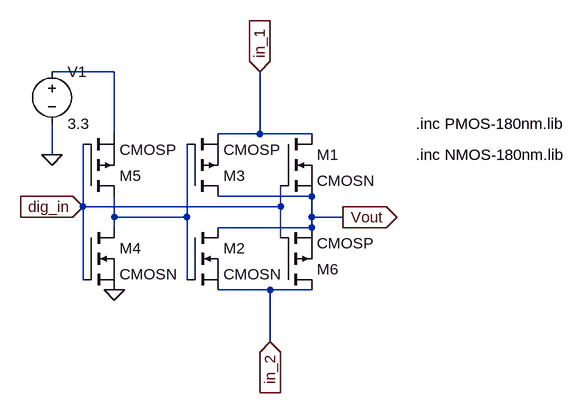
[diagram p0: schematic switch.asc]
switch.asc, the LTspice schematic file:
Version 4
SHEET 1 952 680
WIRE -16 -48 -112 -48
WIRE -16 48 -16 -48
WIRE 208 48 208 -48
WIRE 208 48 144 48
WIRE 288 48 208 48
WIRE -112 80 -112 32
WIRE 288 144 144 144
WIRE -64 160 -64 64
WIRE 240 160 240 128
WIRE 240 160 -64 160
WIRE -16 176 -16 144
WIRE 96 176 96 64
WIRE 96 176 -16 176
WIRE 288 176 288 144
WIRE 336 176 288 176
WIRE -16 192 -16 176
WIRE 288 192 288 176
WIRE 288 192 144 192
WIRE 240 208 240 160
WIRE -64 272 -64 160
WIRE 96 272 96 176
WIRE 224 288 144 288
WIRE 288 288 224 288
WIRE 224 368 224 288
FLAG -16 288 0
FLAG -64 160 dig_in
IOPIN -64 160 In
FLAG 208 -48 in_1
IOPIN 208 -48 In
FLAG 224 368 in_2
IOPIN 224 368 In
FLAG 336 176 Vout
IOPIN 336 176 Out
FLAG -112 80 0
SYMBOL nmos 240 48 R0
SYMATTR InstName M1
SYMATTR Value CMOSN
SYMBOL nmos 96 192 R0
SYMATTR InstName M2
SYMATTR Value CMOSN
SYMBOL nmos -64 192 R0
SYMATTR InstName M4
SYMATTR Value CMOSN
SYMBOL pmos -64 144 M180
SYMATTR InstName M5
SYMATTR Value CMOSP
SYMBOL pmos 240 288 M180
SYMATTR InstName M6
SYMATTR Value CMOSP
SYMBOL pmos 96 144 M180
SYMATTR InstName M3
SYMATTR Value CMOSP
SYMBOL voltage -112 -64 R0
WINDOW 123 0 0 Left 0
WINDOW 39 0 0 Left 0
SYMATTR InstName V1
SYMATTR Value 3.3
TEXT 448 32 Left 2 !.inc PMOS-180nm.lib
TEXT 448 80 Left 2 !.inc NMOS-180nm.lib

The netlist it stands for:
* switch.asc
M1 in_1 dig_in Vout Vout CMOSN
M2 Vout N002 in_2 in_2 CMOSN
M4 N002 dig_in 0 0 CMOSN
M5 N002 dig_in N001 N001 CMOSP
M6 in_2 dig_in Vout Vout CMOSP
M3 Vout N002 in_1 in_1 CMOSP
V1 N001 0 3.3
.model NMOS NMOS
.model PMOS PMOS
.lib standard.mos
.inc PMOS-180nm.lib
.inc NMOS-180nm.lib
.backanno
.end